# EAGLE design Adafruit Voice Bonnet (EAGLE 9.6.2)

## Sheet 1 of 2: I2S Audio
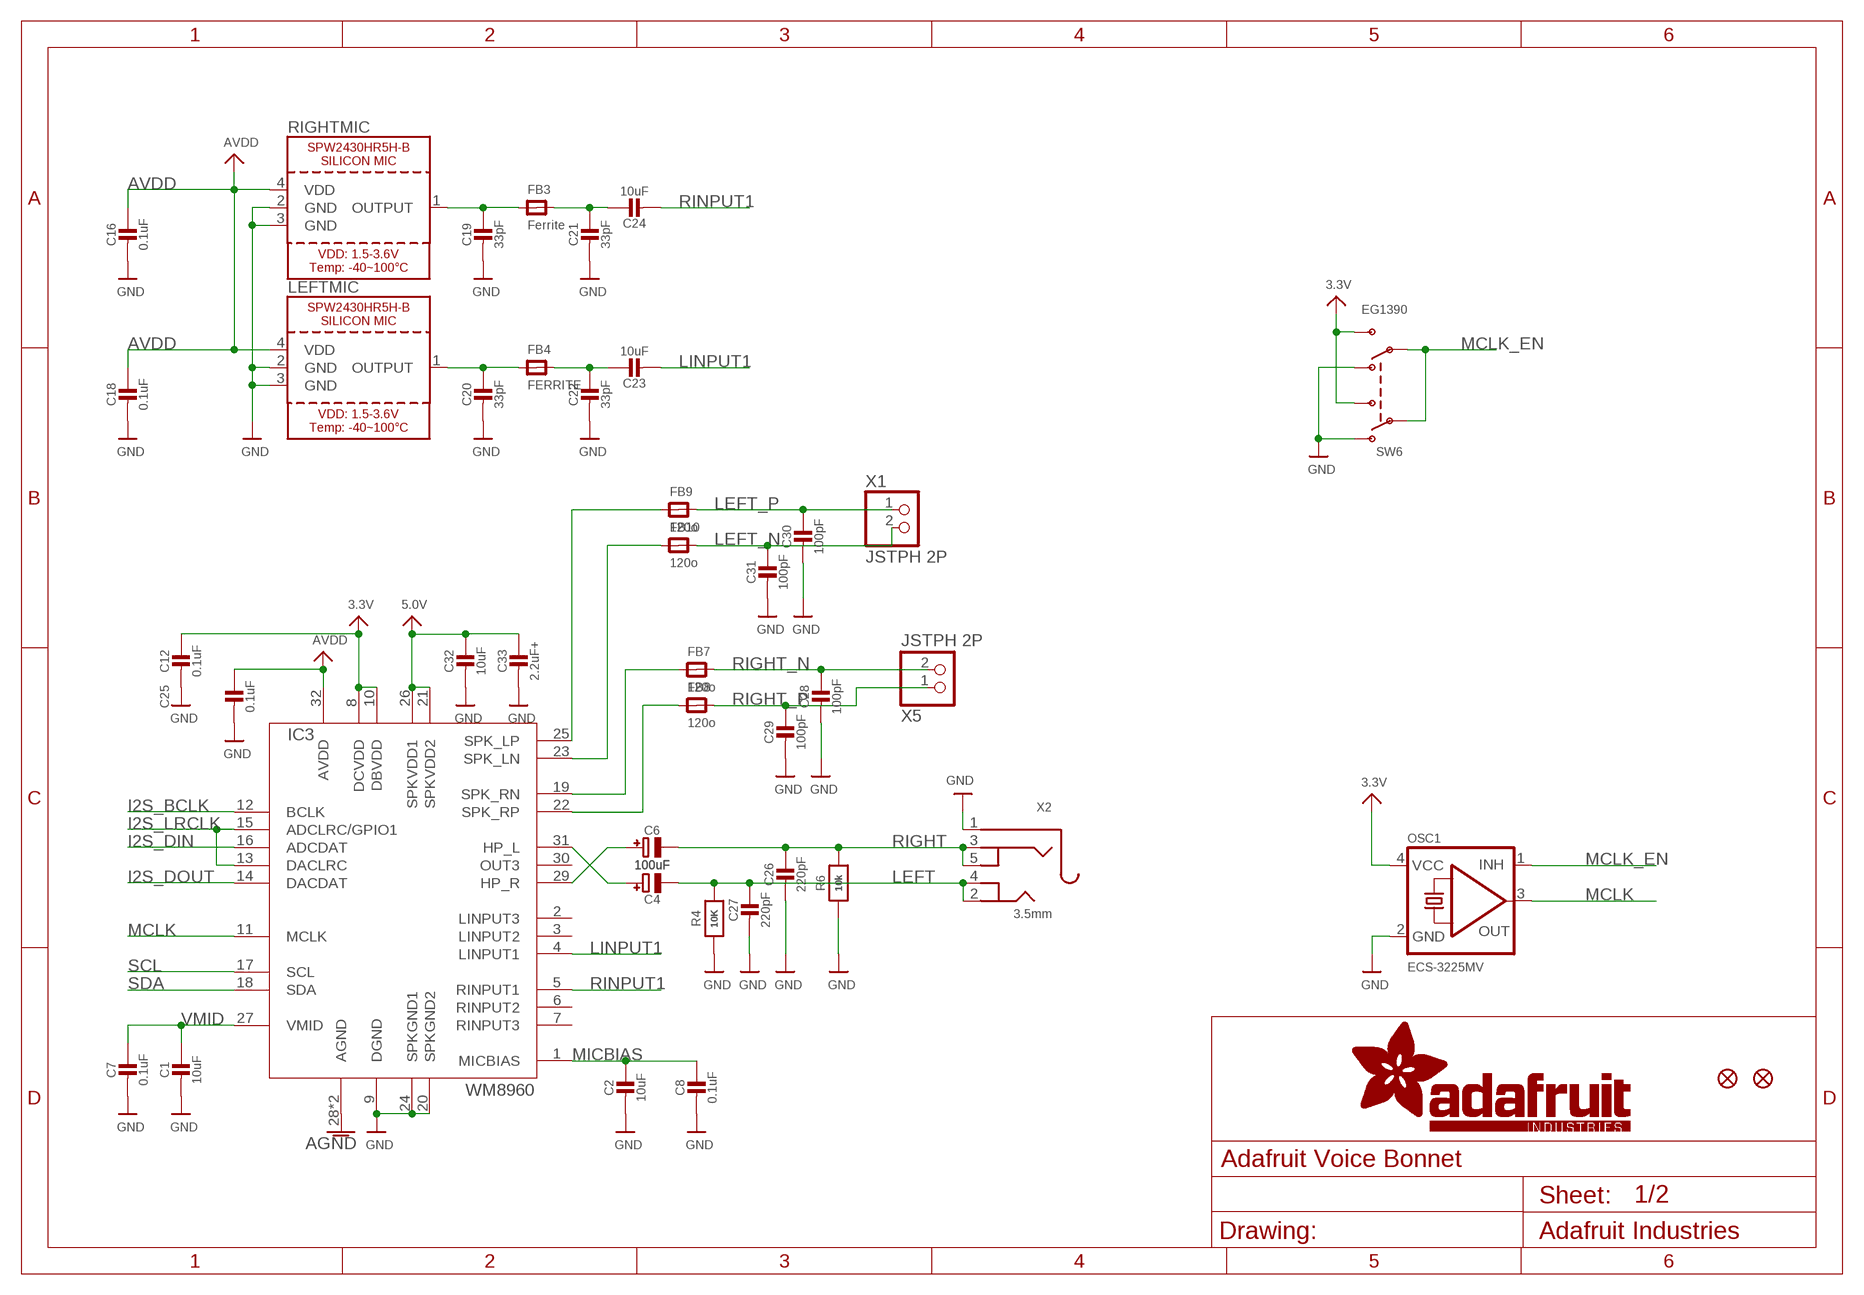
[diagram p0: schematic, sheet 1]

### Parts
C1  10uF  CAP_CERAMIC0805-NOOUTLINE  [0805-NO]
C2  10uF  CAP_CERAMIC0805-NOOUTLINE  [0805-NO]
C4  100uF  CAP_ELECTROLYTICPANASONIC_C  [PANASONIC_C]
C6  100uF  CAP_ELECTROLYTICPANASONIC_C  [PANASONIC_C]
C7  0.1uF  CAP_CERAMIC0603_NO  [0603-NO]
C8  0.1uF  CAP_CERAMIC0603_NO  [0603-NO]
C12  0.1uF  CAP_CERAMIC0603_NO  [0603-NO]
C16  0.1uF  CAP_CERAMIC0603_NO  [0603-NO]
C18  0.1uF  CAP_CERAMIC0603_NO  [0603-NO]
C19  33pF  CAP_CERAMIC0603_NO  [0603-NO]
C20  33pF  CAP_CERAMIC0603_NO  [0603-NO]
C21  33pF  CAP_CERAMIC0603_NO  [0603-NO]
C22  33pF  CAP_CERAMIC0603_NO  [0603-NO]
C23  10uF  CAP_CERAMIC0805-NOOUTLINE  [0805-NO]
C24  10uF  CAP_CERAMIC0805-NOOUTLINE  [0805-NO]
C25  0.1uF  CAP_CERAMIC0603_NO  [0603-NO]
C26  220pF  CAP_CERAMIC0603_NO  [0603-NO]
C27  220pF  CAP_CERAMIC0603_NO  [0603-NO]
C28  100pF  CAP_CERAMIC0603_NO  [0603-NO]
C29  100pF  CAP_CERAMIC0603_NO  [0603-NO]
C30  100pF  CAP_CERAMIC0603_NO  [0603-NO]
C31  100pF  CAP_CERAMIC0603_NO  [0603-NO]
C32  10uF  CAP_CERAMIC0805-NOOUTLINE  [0805-NO]
C33  2.2uF+  CAP_CERAMIC0805-NOOUTLINE  [0805-NO]
FB3  Ferrite  FERRITE-0805NO  [0805-NO]
FB4  FERRITE  FERRITE-0805NO  [0805-NO]
FB7  120o  FERRITE-0805NO  [0805-NO]
FB8  120o  FERRITE-0805NO  [0805-NO]
FB9  120o  FERRITE-0805NO  [0805-NO]
FB10  120o  FERRITE-0805NO  [0805-NO]
FID1  FIDUCIAL_1MM  [FIDUCIAL_1MM]
FID2  FIDUCIAL_1MM  [FIDUCIAL_1MM]
IC3  WM8960  [QFN32_5MM]
LEFTMIC  SPW2430HR5H-B  [SPW2430HR5H-B]
OSC1  ECS-3225MV  OSCILLATOR3.2X2.5  [OSC_3.2X2.5MM]
R4  10K  RESISTOR_0603_NOOUT  [0603-NO]
R6  10k  RESISTOR_0603_NOOUT  [0603-NO]
RIGHTMIC  SPW2430HR5H-B  [SPW2430HR5H-B]
SW6  EG1390  SWITCH_DPDTEG1390  [EG1390]
X1  JSTPH 2P  CON_JST_PH_2PIN  [JSTPH2]
X2  3.5mm  AUDIO_3.5MMJACK  [4UCONN_19269]
X5  JSTPH 2P  CON_JST_PH_2PIN  [JSTPH2]

### Nets
3.3V: C12.1 IC3.8(DCVDD) IC3.10(DBVDD) OSC1.4(VCC) SW6.S1 SW6.S2 ; also sheet 2
5.0V: C32.1 C33.1 IC3.21(SPKVDD2) IC3.26(SPKVDD1) ; also sheet 2
AGND: IC3.28(AGND) IC3.33(AGND) ; also sheet 2
AVDD: C16.1 C18.1 C25.1 IC3.32(AVDD) LEFTMIC.4(VDD) RIGHTMIC.4(VDD) ; also sheet 2
GND: C1.2 C2.2 C7.2 C8.2 C12.2 C16.2 C18.2 C19.2 C20.2 C21.2 C22.2 C25.2 C26.2 C27.2 C28.2 C29.2 C30.2 C31.2 C32.2 C33.2 IC3.9(DGND) IC3.20(SPKGND2) IC3.24(SPKGND1) LEFTMIC.2(GND) LEFTMIC.3(GND) OSC1.2(GND) R4.1 R6.1 RIGHTMIC.2(GND) RIGHTMIC.3(GND) SW6.O1 SW6.O2 X2.1 ; also sheet 2
I2S_BCLK: IC3.12(BCLK) ; also sheet 2
I2S_DIN: IC3.16(ADCDAT) ; also sheet 2
I2S_DOUT: IC3.14(DACDAT) ; also sheet 2
I2S_LRCLK: IC3.13(DACLRC) IC3.15(ADCLRC/GPIO1) ; also sheet 2
LEFT: C4.- C27.1 R4.2 X2.2 X2.4
LEFT_N: C31.1 FB10.2 X1.2
LEFT_P: C30.1 FB9.2 X1.1
LINPUT1: C23.2 IC3.4(LINPUT1)
MCLK: IC3.11(MCLK) OSC1.3(OUT)
MCLK_EN: OSC1.1(INH) SW6.P1 SW6.P2
MICBIAS: C2.1 C8.1 IC3.1(MICBIAS)
N$1: FB7.1 IC3.19(SPK_RN)
N$2: FB8.1 IC3.22(SPK_RP)
N$3: C6.+ IC3.29(HP_R)
N$5: C4.+ IC3.31(HP_L)
N$12: C19.1 FB3.1 RIGHTMIC.1(OUTPUT)
N$13: C20.1 FB4.1 LEFTMIC.1(OUTPUT)
N$16: C21.1 C24.1 FB3.2
N$17: C22.1 C23.1 FB4.2
N$21: FB9.1 IC3.25(SPK_LP)
N$22: FB10.1 IC3.23(SPK_LN)
RIGHT: C6.- C26.1 R6.2 X2.3 X2.5
RIGHT_N: C28.1 FB7.2 X5.2
RIGHT_P: C29.1 FB8.2 X5.1
RINPUT1: C24.2 IC3.5(RINPUT1)
SCL: IC3.17(SCL) ; also sheet 2
SDA: IC3.18(SDA) ; also sheet 2
VMID: C1.1 C7.1 IC3.27(VMID)
Unconnected: IC3.2(LINPUT3) IC3.3(LINPUT2) IC3.6(RINPUT2) IC3.7(RINPUT3) IC3.30(OUT3)

## Sheet 2 of 2: RasPi Hat & Power
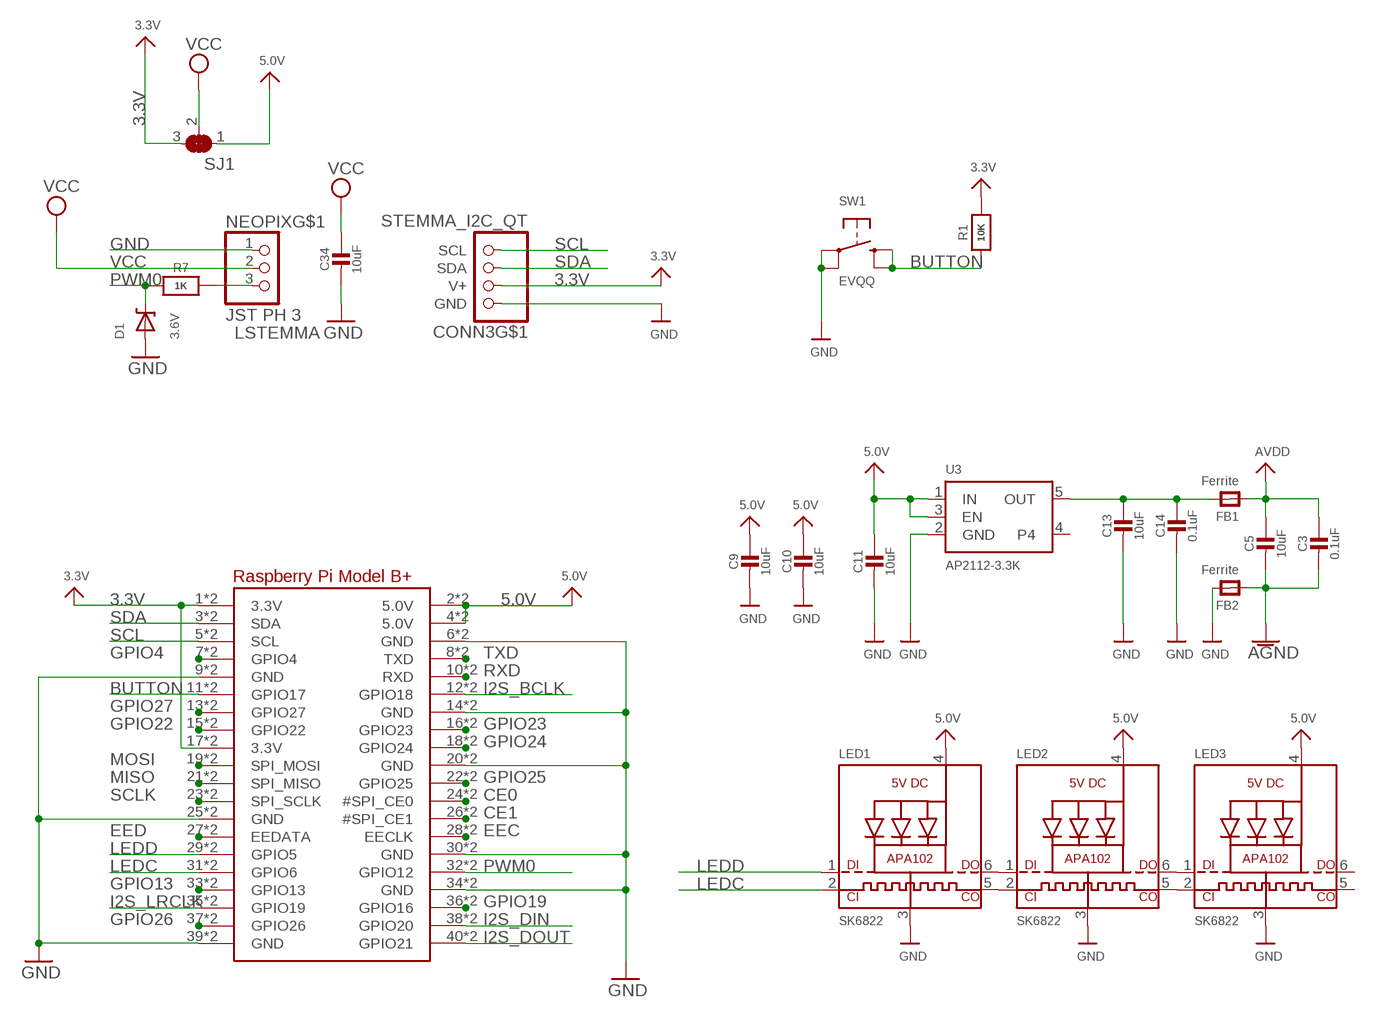
[diagram p1: schematic, sheet 2]

### Parts
C3  0.1uF  CAP_CERAMIC0603_NO  [0603-NO]
C5  10uF  CAP_CERAMIC0805-NOOUTLINE  [0805-NO]
C9  10uF  CAP_CERAMIC0805-NOOUTLINE  [0805-NO]
C10  10uF  CAP_CERAMIC0805-NOOUTLINE  [0805-NO]
C11  10uF  CAP_CERAMIC0805-NOOUTLINE  [0805-NO]
C13  10uF  CAP_CERAMIC0805-NOOUTLINE  [0805-NO]
C14  0.1uF  CAP_CERAMIC0603_NO  [0603-NO]
C34  10uF  CAP_CERAMIC0805-NOOUTLINE  [0805-NO]
CONN3  STEMMA_I2C_QT  [JST_SH4]
D1  3.6V  DIODE-ZENERSOD323  [SOD-323]
FB1  Ferrite  FERRITE0805  [0805]
FB2  Ferrite  FERRITE0805  [0805]
LED1  SK6822  APA102  [APA102]
LED2  SK6822  APA102  [APA102]
LED3  SK6822  APA102  [APA102]
NEOPIX  JST PH 3  CON_JST_PH_3PIN  [JSTPH3]
R1  10K  RESISTOR_0603_NOOUT  [0603-NO]
R7  1K  RESISTOR_0603_NOOUT  [0603-NO]
RPI1  RASPBERRYPI_BPLUS_BONNET_THMSMT  [PI_BONNET_THMSMT]
SJ1  SOLDERJUMPER_2WAY  [SOLDERJUMPER_2WAY_OPEN_NOPASTE]
SW1  EVQQ  SWITCH_TACT_SMT_EVQQ2_SMALL  [EVQ-Q2_SMALLER]
U3  AP2112-3.3K  VREG_SOT23-5  [SOT23-5]

### Nets
3.3V: CONN3.2(V+) R1.2 RPI1.1(3.3V) RPI1.17(3.3V) RPI1.S1(3.3V) RPI1.S17(3.3V) SJ1.3 ; also sheet 1
5.0V: C9.1 C10.1 C11.1 LED1.4(VDD) LED2.4(VDD) LED3.4(VDD) RPI1.2(5.0V) RPI1.4(5.0V) RPI1.S2(5.0V) RPI1.S4(5.0V) SJ1.1 U3.1(IN) U3.3(EN) ; also sheet 1
AGND: C3.2 C5.2 FB2.1 ; also sheet 1
AVDD: C3.1 C5.1 FB1.1 ; also sheet 1
BUTTON: R1.1 RPI1.11(GPIO17) RPI1.S11(GPIO17) SW1.B'(S1) SW1.B(S)
CE0: RPI1.24(#SPI_CE0) RPI1.S24(#SPI_CE0)
CE1: RPI1.26(#SPI_CE1) RPI1.S26(#SPI_CE1)
EEC: RPI1.28(EECLK) RPI1.S28(EECLK)
EED: RPI1.27(EEDATA) RPI1.S27(EEDATA)
GND: C9.2 C10.2 C11.2 C13.2 C14.2 C34.2 CONN3.1(GND) D1.A FB2.2 LED1.3(GND) LED2.3(GND) LED3.3(GND) NEOPIX.1 RPI1.6(GND) RPI1.9(GND) RPI1.14(GND) RPI1.20(GND) RPI1.25(GND) RPI1.30(GND) RPI1.34(GND) RPI1.39(GND) RPI1.S6(GND) RPI1.S9(GND) RPI1.S14(GND) RPI1.S20(GND) RPI1.S25(GND) RPI1.S30(GND) RPI1.S34(GND) RPI1.S39(GND) SW1.A'(P1) SW1.A(P) U3.2(GND) ; also sheet 1
GPIO4: RPI1.7(GPIO4) RPI1.S7(GPIO4)
GPIO13: RPI1.33(GPIO13) RPI1.S33(GPIO13)
GPIO19: RPI1.36(GPIO16) RPI1.S36(GPIO16)
GPIO22: RPI1.15(GPIO22) RPI1.S15(GPIO22)
GPIO23: RPI1.16(GPIO23) RPI1.S16(GPIO23)
GPIO24: RPI1.18(GPIO24) RPI1.S18(GPIO24)
GPIO25: RPI1.22(GPIO25) RPI1.S22(GPIO25)
GPIO26: RPI1.37(GPIO26) RPI1.S37(GPIO26)
GPIO27: RPI1.13(GPIO27) RPI1.S13(GPIO27)
I2S_BCLK: RPI1.12(GPIO18) RPI1.S12(GPIO18) ; also sheet 1
I2S_DIN: RPI1.38(GPIO20) RPI1.S38(GPIO20) ; also sheet 1
I2S_DOUT: RPI1.40(GPIO21) RPI1.S40(GPIO21) ; also sheet 1
I2S_LRCLK: RPI1.35(GPIO19) RPI1.S35(GPIO19) ; also sheet 1
LEDC: LED1.2(CKI) RPI1.31(GPIO6) RPI1.S31(GPIO6)
LEDD: LED1.1(DI) RPI1.29(GPIO5) RPI1.S29(GPIO5)
LSTEMMA: NEOPIX.3 R7.1
MISO: RPI1.21(SPI_MISO) RPI1.S21(SPI_MISO)
MOSI: RPI1.19(SPI_MOSI) RPI1.S19(SPI_MOSI)
N$7: LED1.6(DO) LED2.1(DI)
N$11: LED1.5(CKO) LED2.2(CKI)
N$14: LED2.6(DO) LED3.1(DI)
N$15: LED2.5(CKO) LED3.2(CKI)
OUT: C13.1 C14.1 FB1.2 U3.5(OUT)
PWM0: D1.C R7.2 RPI1.32(GPIO12) RPI1.S32(GPIO12)
RXD: RPI1.10(RXD) RPI1.S10(RXD)
SCL: CONN3.4(SCL) RPI1.5(SCL) RPI1.S5(SCL) ; also sheet 1
SCLK: RPI1.23(SPI_SCLK) RPI1.S23(SPI_SCLK)
SDA: CONN3.3(SDA) RPI1.3(SDA) RPI1.S3(SDA) ; also sheet 1
TXD: RPI1.8(TXD) RPI1.S8(TXD)
VCC [power]: C34.1 NEOPIX.2 SJ1.2
Unconnected: CONN3.MT1(MT) CONN3.MT2(MT) LED3.5(CKO) LED3.6(DO) NEOPIX.NC1(MT) NEOPIX.NC2(MT) U3.4

## Library data of the parts
C1-C3 C5 C7-C14 C16 C18-C34 = microbuilder:CAP_CERAMIC: Ceramic Capacitors For new designs, use the packages preceded by an '_' character since they are more reliable: The following footprints should be used on most boards: _0402 - Standard footprint for regular board layouts _0603 - Standard footprint for regular board layouts _0805 - Standard footprint for regular board layouts _1206 - Standard footprint for regular board layouts For extremely tight-pitch boards where space is at a premium, the following 'micro-pitch' footprints can be used (smaller pads, no silkscreen outline, etc.): _0402MP - Micro-pitch footprint for very dense/compact boards _0603MP - Micro-pitch footprint for very dense/compact boards _0805MP - Micro-pitch footprint for very dense/compact boards _1206MP - Micro-pitch footprint for very dense/compact boards
C4 C6 = microbuilder:CAP_ELECTROLYTIC: Electrolytic Capacitors SMT PANASONIC_C - Size C Panasonic Electrolytic Aluminum Capacitor 47µF 16V 20% Electrolytic Capacitor [Digikey: PCE3890TR-ND] PANASONIC_D - Size D Panasonic Electrolytic Aluminum Capacitor 100µF 25V 20% Electrolytic Capacitor [Digikey: PCE3898TR-ND] PTH 3.5 mm grid, 8 mm diameter ... 3.5 mm grid, 10 mm diameter ...
CONN3 = microbuilder:STEMMA_I2C
D1 = microbuilder:DIODE-ZENER: Zener Diode SMA: 30V 1W Zener Diode, 1.2Vf - Digikey: SMAZ30-FDICT-ND
FB1-FB4 FB7-FB10 = microbuilder:FERRITE: Ferrite Bead 0603 MMZ1608B121C - 120 Ohm @ 100MHz, 600mA, 0.15 Ohm DC Resistance - Digikey: 445-2164-1-ND BK1608HW121-T - 120 Ohm, 600mA Ferrite Chip - Digikey: 587-1876-2-ND 0805 HZ0805B272R-10 - 2.7K Ohm @ 100MHz, 200mA, 0.8 Ohm DC Resistance - Digikey: 240-2504-1-ND (see also Murata BLM21BD272SN1L) MMZ2012Y152B - 1.5K Ohm @ 100MHz, 500mA, 0.4 Ohm DC Resistance - Digikey: 445-1560-1-ND - Mainly for high frequency (80-400MHz) MMZ2012R102A - 1K Ohm @ 100MHz, 500mA, 0.3 Ohm DC Resistance - Digikey: 445-1555-2-ND - More general purpose (10-200MHz)
FID1 FID2 = microbuilder:FIDUCIAL: Fiducial Alignment Points Various fiducial points for machine vision alignment.; BOM: EXCLUDE
IC3 = microbuilder:WM8960
LED1-LED3 = microbuilder:APA102: APA102/DotStar Pixels VCC: 5V DC Refresh Rate: 400Hz
LEFTMIC RIGHTMIC = microbuilder:SPW2430HR5H-B: SPW2430HR5H-B - Silicon Microphone
NEOPIX = microbuilder:CON_JST_PH_3PIN
OSC1 = microbuilder:OSCILLATOR: Oscillators 3.2x2.5mm SMT 4.0MHz +/- 50ppm, 3.3V, 9mA, -40/+85°C - Digikey: 535-9752-1-ND 50MHz +/- 50ppm, 3.3V, 8mA, -10/+70°C - Digikey: 478-4792-1-ND 5x7mm SMT 4.0MHz +/-20ppm 3.3V, 20mA, -20/+70°C - Digikey: 535-9329-2-ND 50MHz +/- 25ppm 3.3V, 35mA, -40/+85°C - Digikey: 631-1197-1-ND
R1 R4 R6 R7 = microbuilder:RESISTOR: Resistors For new designs, use the packages preceded by an '_' character since they are more reliable: The following footprints should be used on most boards: _0402 - Standard footprint for regular board layouts _0603 - Standard footprint for regular board layouts _0805 - Standard footprint for regular board layouts _1206 - Standard footprint for regular board layouts For extremely tight-pitch boards where space is at a premium, the following 'micro-pitch' footprints can be used (smaller pads, no silkscreen outline, etc.): _0402MP - Micro-pitch footprint for very dense/compact boards _0603MP - Micro-pitch footprint for very dense/compact boards _0805MP - Micro-pitch footprint for very dense/compact boards _1206MP - Micro-pitch footprint for very dense/compact boards
RPI1 = adafruit_sbc:RASPBERRYPI_BPLUS
SJ1 = microbuilder:SOLDERJUMPER_2WAY: 2-Way Solder Jumper
SW1 = microbuilder:SWITCH_TACT_SMT: SMT Tact Switches 6x6mm - Digikey: P12940SCT-ND KMR2 (4.6x2.8mm) - Digikey: 401-1426-1-ND EVQ-PQHB55 - Light Touch, 160GF (4.5x4.5mm) - Digikey: P8090SCT-ND KMT0 - KMT021 NGJ LHS (etc.) IP68/Waterproof - Digikey: CKN10289CT-ND
SW6 = microbuilder:SWITCH_DPDT: Switch - DPDT A DPDT Switch acts like an SPDT switch, but has a pair of switches instead of just one. Vertical - 0.3A @ 6V SMT - Digikey: JS202011SCQN
U3 = microbuilder:VREG_SOT23-5: SOT23-5 Fixed Voltage Regulators Part Current Out V Out V In V Dropout θJA (°C/W) TJ (°C) Digikey Part No. ADP121 150mA 3.3V 3.4-5.5V 0.09V @ 150mA -- -- ADP121-AUJZ33R7CT-ND ADP121 150mA 3.0V 3.1-5.5V 0.09V @ 150mA -- -- ADP121-AUJZ30R7CT-ND ADP122 300mA 3.3V 3.4-5.5V 0.085V @ 300mA -- -- ADP122AUJZ-3.3-R7CT-ND ADP1712 300mA 3.3V 3.5-5.5V 0.17V @ 300mA -- -- ADP1712AUJZ-3.3-R7TR-ND AP7311 (Low Cost) 150mA 3.3V 3.5-6V 0.15V @ 150mA -- -- AP7311-33WG-7DICT-ND LD39015M18R 150mA 1.8V 1.9V-5.5V 0.08V @ 100mA -- -- 497-6977-1-ND LP2985A-33DBVR 150mA 3.3V 3.3-16V 0.28V @ 150mA 206 150 296-18479-1-ND MCP1824T-3302E/OT 300mA 3.3V 3.5V-6V 0.2V @ 300mA -- -- MCP1824T-3302E/OTCT-ND MIC5205-2.5YM5 TR 150mA 2.5V 2.7-16V 0.165V @ 150mA -- -- 576-1257-2-ND MIC5205-3.0YM5 TR 150mA 3.0V 3.2V-16V 0.165V @ 150mA -- -- 576-1258-2-ND MIC5205-3.3YM5 TR 150mA 3.3V 3.5V-16V 0.165V @ 150mA -- -- 576-1259-2-ND TPS780330220 150mA 3.3V+2.2V 3.6-5.5V 250mV Max -- -- 296-23332-1-ND TDA3663/N1,135 100mA 3.3V 3.5-45V 0.18V @ 50mA -- -- 568-5343-1-ND Max operating temp can be calculated using θJA, TJ (max junction temperature), and power in watts. Set the "Maximum Ambient Temperature" until it reaches TJ ("Max Junction Temperature"), which is the absolute limit for safe use of the regulator: Heat Sink Temperature Calculator <http://www.daycounter.com/Calculators/Heat-Sink-Temperature-Calculator.phtml> For example, With 12V source into a 3.3V LP2985 and a 30mA load, we are dissipating (12V-3.3V) * 0.03A = 0.261W. With a θJA of 206 °C/W, a TJ of 150°C, and 261mW we can safely use the chip without a heat sink up to 75°C (=147.1°C Junction Temperature).
X1 X5 = microbuilder:CON_JST_PH_2PIN: JST 2-Pin Right-Angle Connector PH-Series - 4UConnector: 17311 SH-Series - 4UConnector: 07278
X2 = microbuilder:AUDIO_3.5MMJACK: 3.5MM Audio Jack These are normally connected as follows, from left-to right on the schematic symbol above: Tip: Left Audio Inner Ring: Right Audio Shell: Common/GND

## Net classes
1 power: width 0.305 mm

## Board
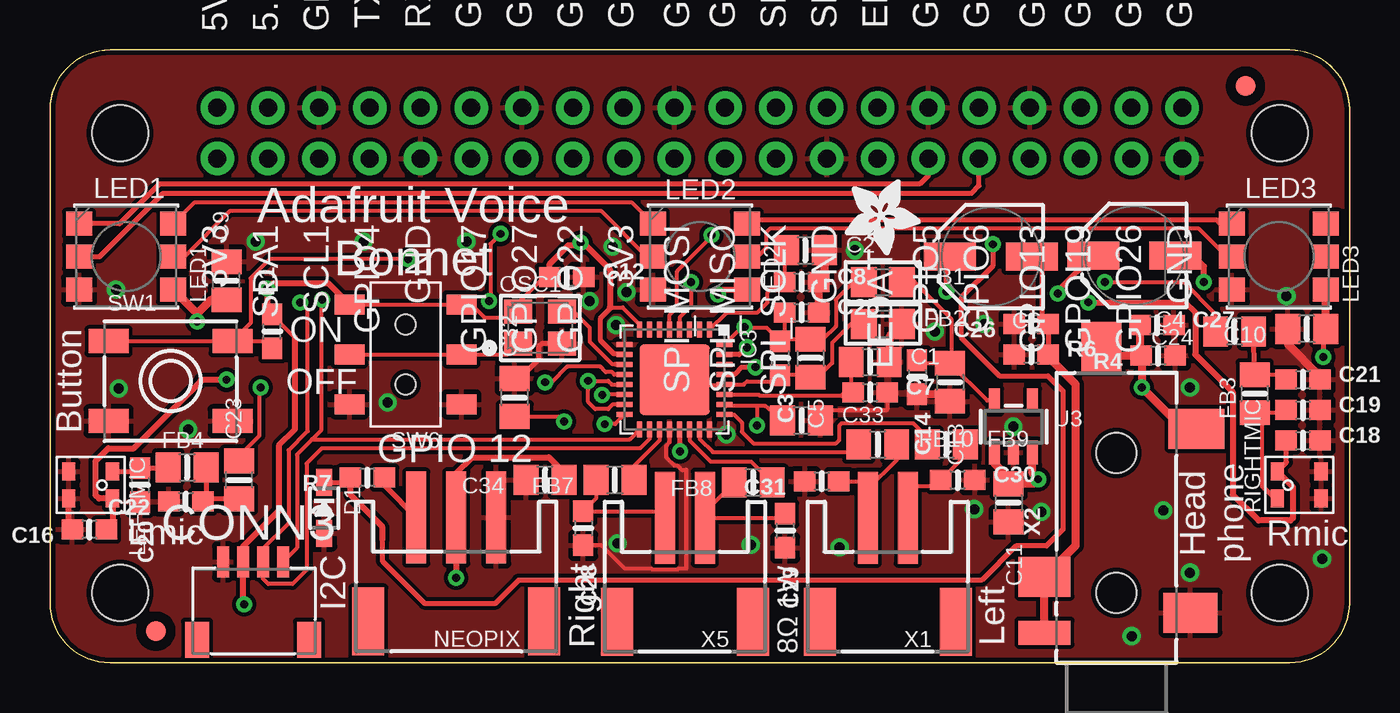
[diagram p2: board, top side]
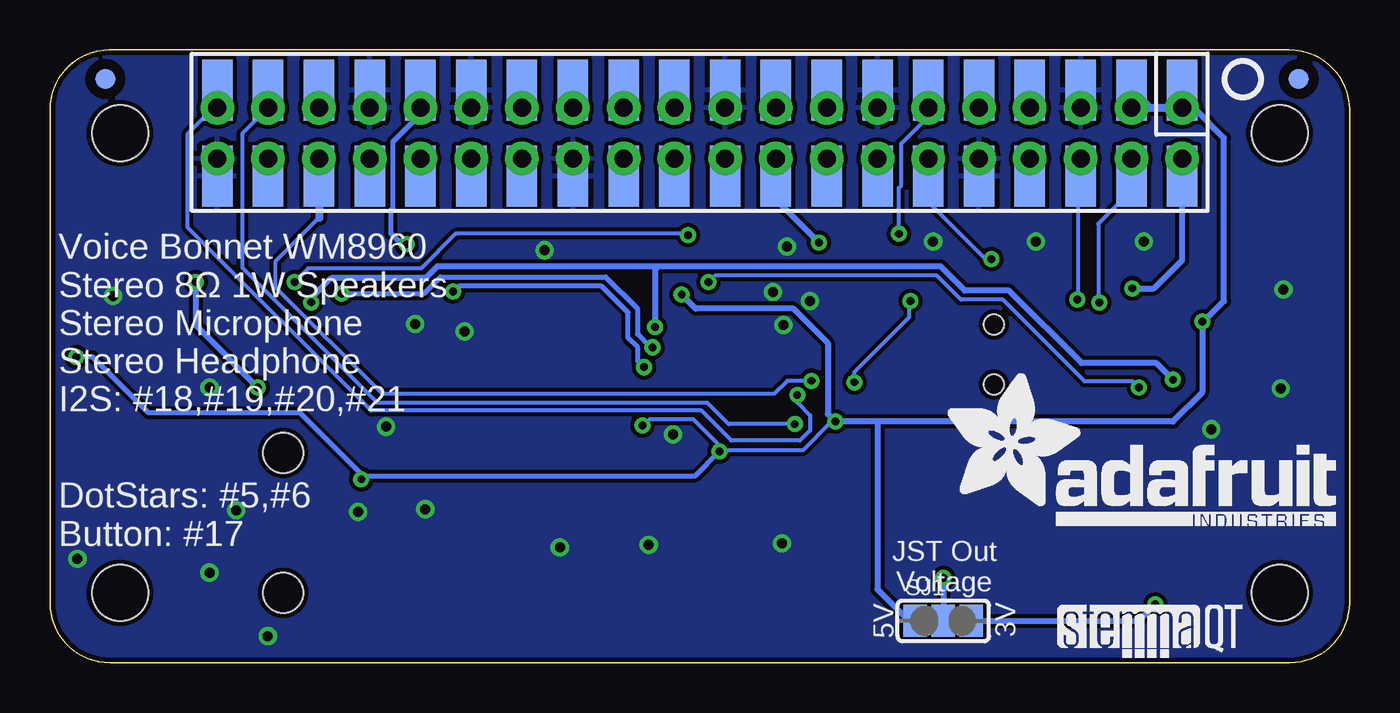
[diagram p3: board, bottom side, seen from below]

Size 65 x 30.66 mm. Coordinates in mm from the lower left corner, seen from the top.
Outline: 62,0 3,0 arc-90 0,3 0,27.7 arc-90 3.02,30.66 62.02,30.66 arc-90 65,27.7 65,3 arc-90 62,0
Copper layers (1*16): Top 0.035mm / dielectric 1.5mm / Bottom 0.035mm
Design rules "adafruit": minimum track width 8mil, minimum drill 15.5mil, track to track 8mil, track to pad 8mil, pad to pad 8mil, via to via 8mil, smd to smd 8mil, copper to edge 10mil, drill to drill 8mil, minimum pad ring 10mil, minimum via ring 8mil, stop-mask expansion 2mil, vias tented up to drill 20mil, thermal gap 10mil

### Footprints (pad centres in the part's own frame; a part is rotated, then mirrored left to right if it is on the bottom)
0805-NO = smd 1.24 x 1.5: 1 -0.95,0; 2 0.95,0
0603-NO = smd 1.075 x 1: 1 -0.85,0; 2 0.85,0
PANASONIC_C = smd 2.6 x 1.4: + 2.05,0; - -2.05,0
JST_SH4 = smd 0.6 x 1.55: 1 -1.5,2.514; 2 -0.5,2.514; 3 0.5,2.514; 4 1.5,2.514 | smd 1.2 x 1.8: MT1 -2.8,-1.386; MT2 2.8,-1.386
SOD-323 = smd 1.35 x 0.8: A 1.27,0; C -1.27,0
0805 = smd 1.3 x 1.5: 1 -0.95,0; 2 0.95,0
FIDUCIAL_1MM = smd 1 x 1: 1 0,0
QFN32_5MM = smd 0.8 x 0.25: 1 -2.5,1.75; 2 -2.5,1.25; 3 -2.5,0.75; 4 -2.5,0.25; 5 -2.5,-0.25; 6 -2.5,-0.75; 7 -2.5,-1.25; 8 -2.5,-1.75; 17 2.5,-1.75; 18 2.5,-1.25; 19 2.5,-0.75; 20 2.5,-0.25; 21 2.5,0.25; 22 2.5,0.75; 23 2.5,1.25; 24 2.5,1.75 | smd 0.25 x 0.8: 9 -1.75,-2.5; 10 -1.25,-2.5; 11 -0.75,-2.5; 12 -0.25,-2.5; 13 0.25,-2.5; 14 0.75,-2.5; 15 1.25,-2.5; 16 1.75,-2.5; 25 1.75,2.5; 26 1.25,2.5; 27 0.75,2.5; 28 0.25,2.5; 29 -0.25,2.5; 30 -0.75,2.5; 31 -1.25,2.5; 32 -1.75,2.5 | smd 3.5 x 3.5: 33 0,0
APA102 = smd 1.3 x 1.2: 1 -2.35,1.65; 2 -2.35,0; 3 -2.35,-1.65; 4 2.35,-1.65; 5 2.35,0; 6 2.35,1.65
SPW2430HR5H-B = smd 0.9 x 0.66: 1 -0.675,1.095; 2 -0.675,-1.095; 3 0.675,-1.095; 4 0.675,1.095
JSTPH3 = smd 1 x 4.6: 1 -2,-2.7; 2 0,-2.7; 3 2,-2.7 | smd 1.6 x 3.4: NC1 -4.4,2.5; NC2 4.4,2.5
OSC_3.2X2.5MM = smd 1.4 x 1.2: 1 -1.1,-0.8; 2 1.1,-0.8; 3 1.1,0.8; 4 -1.1,0.8
PI_BONNET_THMSMT = drill 0.9 pad 1.676: 1 8.37,25.23; 2 8.37,27.77; 3 10.91,25.23; 4 10.91,27.77; 5 13.45,25.23; 6 13.45,27.77; 7 15.99,25.23; 8 15.99,27.77; 9 18.53,25.23; 10 18.53,27.77; 11 21.07,25.23; 12 21.07,27.77; 13 23.61,25.23; 14 23.61,27.77; 15 26.15,25.23; 16 26.15,27.77; 17 28.69,25.23; 18 28.69,27.77; 19 31.23,25.23; 20 31.23,27.77; 21 33.77,25.23; 22 33.77,27.77; 23 36.31,25.23; 24 36.31,27.77; 25 38.85,25.23; 26 38.85,27.77; 27 41.39,25.23; 28 41.39,27.77; 29 43.93,25.23; 30 43.93,27.77; 31 46.47,25.23; 32 46.47,27.77; 33 49.01,25.23; 34 49.01,27.77; 35 51.55,25.23; 36 51.55,27.77; 37 54.09,25.23; 38 54.09,27.77; 39 56.63,25.23; 40 56.63,27.77 | smd 1 x 1 bottom: 41 2.54,29.21; 42 62.23,29.21 | smd 1.524 x 3.048 bottom: S1 8.37,24.339; S2 8.37,28.657; S3 10.91,24.339; S4 10.91,28.657; S5 13.45,24.339; S6 13.45,28.657; S7 15.99,24.339; S8 15.99,28.657; S9 18.53,24.339; S10 18.53,28.657; S11 21.07,24.339; S12 21.07,28.657; S13 23.61,24.339; S14 23.61,28.657; S15 26.15,24.339; S16 26.15,28.657; S17 28.69,24.339; S18 28.69,28.657; S19 31.23,24.339; S20 31.23,28.657; S21 33.77,24.339; S22 33.77,28.657; S23 36.31,24.339; S24 36.31,28.657; S25 38.85,24.339; S26 38.85,28.657; S27 41.39,24.339; S28 41.39,28.657; S29 43.93,24.339; S30 43.93,28.657; S31 46.47,24.339; S32 46.47,28.657; S33 49.01,24.339; S34 49.01,28.657; S35 51.55,24.339; S36 51.55,28.657; S37 54.09,24.339; S38 54.09,28.657; S39 56.63,24.339; S40 56.63,28.657 | hole 2.8: 3.5,26.5; 61.5,26.5; 61.5,3.5; 3.5,3.5
SOLDERJUMPER_2WAY_OPEN_NOPASTE = smd 1.168 x 1.6: 1 -1.397,0; 2 0,0; 3 1.397,0
EVQ-Q2_SMALLER = smd 2 x 1.2: A -3.1,-2; A' 3.1,-2; B -3.1,2; B' 3.1,2
EG1390 = smd 1 x 1.5: O1 -2.5,2.8; O2 -2.5,-2.8; P1 0,2.8; P2 0,-2.8; S1 2.5,2.8; S2 2.5,-2.8 | hole 1: 1.5,0; -1.5,0
SOT23-5 = smd 0.55 x 1.2: 1 -0.95,-1.3; 2 0,-1.3; 3 0.95,-1.3; 4 0.95,1.3; 5 -0.95,1.3
JSTPH2 = smd 1 x 4.6: 1 -1,-3.7; 2 1,-3.7 | smd 1.6 x 3.4: NC1 -3.4,1.5; NC2 3.4,1.5
4UCONN_19269 = smd 2 x 2.7: 1 2.5,-3.7 | smd 2 x 2.8: 2 11.7,-4 | smd 2 x 2.6: 3 4.3,3.6 | smd 2.5 x 2: 4 15.8,0.75 | smd 1.2 x 2.6: 5 1.5,3.6 | hole 2: 3.5,0; 10.5,0

### Placement (x,y rotation side)
C1  41.02,15.05 0 top
C2  37.78,20.64 0 top
C3  36.51,15.24 270 top
C4  54.23,20.38 180 top
C5  38.04,15.24 270 top
C6  47.05,20.32 180 top
C7  41.02,13.53 0 top
C8  37.59,19.05 0 top
C9  8.83,19.11 90 top
C10  62.87,16.7 180 top
C11  47.94,8 270 top
C12  25.84,19.3 0 top
C13  45.02,14.03 270 top
C14  43.37,14.29 270 top
C16  1.97,6.67 180 top
C18  62.67,11.11 0 top
C19  62.67,12.64 0 top
C20  4.51,8.89 270 top
C21  62.67,14.16 0 top
C22  6.79,8.06 180 top
C23  9.46,9.14 90 top
C24  59.25,16.57 180 top
C25  37.59,17.53 0 top
C26  49.09,16.95 180 top
C27  55.37,16.89 0 top
C28  26.67,6.73 270 top
C29  36.77,6.6 270 top
C30  45.4,9.14 0 top
C31  38.61,9.08 180 top
C32  23.24,13.27 90 top
C33  37.59,12.13 0 top
C34  24.77,9.14 180 top
CONN3  10.16,2.54 0 top
D1  13.72,7.75 270 top
FB1  41.66,19.05 0 top
FB2  41.66,16.95 0 top
FB3  60.26,13.46 90 top
FB4  6.86,9.78 0 top
FB7  28.26,9.14 180 top
FB8  35.18,9.02 180 top
FB9  44.83,10.92 0 top
FB10  41.4,10.92 0 top
FID1  5.3,1.58 0 top
FID2  59.8,28.85 0 top
IC3  31.24,14.16 270 top
LED1  3.81,20.32 0 top
LED2  32.51,20.32 0 top
LED3  61.47,20.32 0 top
LEFTMIC  2.03,8.89 270 top
NEOPIX  20.32,4.57 180 top
OSC1  24.51,16.76 0 top
R1  11.11,16.57 90 top
R4  55.44,15.37 180 top
R6  49.09,15.43 0 top
R7  15.88,9.27 180 top
RIGHTMIC  62.48,8.89 90 top
RPI1  0,0 0 top
SJ1  20.32,2.1 0 bottom
SW1  6.03,14.1 0 top
SW6  17.78,15.43 90 top
U3  48.2,11.81 0 top
U$11  [PCBFEAT-REV-040]  5.33,29.2 0 bottom
U$12  [STEMMAQT]  14.61,0.25 0 bottom
U$15  [ADAFRUIT_3.5MM]  39.75,24.19 270 top
U$16  [ADAFRUIT_TEXT_20MM]  20.26,6.86 0 bottom
U$79  [BRAINPAD_1IN]  43.81,0.25 0 bottom
X1  41.91,3.56 180 top
X2  53.34,0 90 top
X5  31.75,3.56 180 top

### Tracks (layer width: path | path; a pad name or v marks a point on that pad's centre or on a via)
3.3V  (via drill 0.39)
  Top 0.203: 28,17.78 28.07,17.78 28.64,17.78 29.49,16.93 IC3.8 | C12.1 24.71,19.3 23.41,18.01 OSC1.4 23.09,17.25 21.76,17.25 21.08,17.93 SW6.S2 SW6.S1 | 12.26,16.26 11.11,17.4 R1.2
  Top 0.254: IC3.10 28.7,15.46 28.2,15.46 27.54,16.12 27.54,17.25 28.07,17.78
  Top 0.305: v9.72,2.92 9.66,2.98 CONN3.2 9.66,5.82 11.44,7.59 11.44,10.87 12.26,11.68 12.26,16.26 | C12.1 24.99,19.95 25.93,20.89 26.61,20.89 | 26.61,20.89 26.8,20.89 28,19.68 28,17.78 | R1.2 10.86,17.68 v10.86,18.73 11.11,18.99 13.92,18.99 SW6.S1 | 26.61,20.89 26.61,20.95 v26.54,21.02
  Bottom 0.305: SJ1.3 10.54,2.1 v9.72,2.92 | v10.86,18.73 9.78,18.73 8.37,20.14 RPI1.S1 | v26.54,21.02 28.69,23.16 28.69,24.89
  Bottom 0.406: RPI1.S17 28.69,24.89 RPI1.17 | RPI1.17 | RPI1.S1 RPI1.1 | RPI1.1
5.0V  (via drill 0.39)
  Top 0.203: C32.1 25.45,12.32 v25.71,12.06 | C33.1 35.78,12.85 35.37,12.85 | 35.37,12.85 33.81,12.85 IC3.26 | 35.37,12.85 v35.37,11.87
  Top 0.254: IC3.21 31.49,10.59 v31.52,10.57 | v63.69,15.3 63.69,16.96 63.81,17.08
  Top 0.305: v33.4,18.41 33.66,18.67 LED2.4
  Top 0.406: LED3.4 63.82,17.34 63.81,17.33 63.81,17.08 C10.1 | U3.1 47.25,9.96 47.94,9.27 C11.1 49.19,8.95 v49.42,9.19 49.15,9.46 U3.3 | LED1.4 7.37,17.46 | 7.37,17.46 v7.37,17.08 | C9.1 8.07,18.16 7.37,17.46
  Bottom 0.203: v25.71,12.06 25.91,12.06 27.34,10.63 31.45,10.63 | v31.52,10.57 31.52,10.88 32.83,12.19 34.99,12.19 35.31,11.87 v35.37,11.87
  Bottom 0.254: 31.45,10.63 v31.52,10.57 32.72,9.36 49.25,9.36 | v49.42,9.19 49.25,9.36 | 49.25,9.36 49.33,9.36 52.48,12.51 60.07,12.51 62.87,15.3 v63.69,15.3
  Bottom 0.305: v7.37,17.08 7.37,17.02 | 7.37,17.02 7.37,13.53 8.83,12.06 23.62,12.06 | 23.62,12.06 v25.71,12.06 26.09,12.45 26.09,16 27.81,17.72 32.7,17.72 v33.4,18.41 | 23.62,12.06 23.62,3.68 22.04,2.1 SJ1.1 | 7.37,17.02 6.29,18.1 6.29,26.26 7.8,27.77 RPI1.2
  Bottom 0.406: RPI1.S4 | RPI1.S4 RPI1.4 | RPI1.S4 10.02,27.77 RPI1.2 RPI1.S2 | RPI1.S2
AGND
  Top 0.203: IC3.33 31.94,14.16 32.19,13.91 IC3.28 34.69,13.91 34.86,14.08 36.2,14.08 C3.2 37.94,14.39 C5.2 38.42,14.29 39.12,14.99 39.12,16 40.07,16.95 FB2.1
AVDD  (via drill 0.39)
  Top 0.203: FB1.1 40.2,19.05 39.31,18.16 39.31,16.83 38.67,16.19 C5.1 36.61,16.19 C3.1 | IC3.32 34.6,16.76 34.71,16.76 | C3.1 35.84,16.76 34.8,16.76 34.77,16.79 v34.73,16.79 | C25.1 36.74,16.32 C3.1
  Top 0.254: RIGHTMIC.4 61.85,10.03 61.85,11.09 C18.1
  Top 0.305: C16.1 3.13,6.98 LEFTMIC.4 2.45,8.21 2.29,8.38 2.29,10.1 2.92,10.73 4.19,10.73 7.56,14.1 7.56,14.16 v8.83,14.16 | v34.73,16.79 34.71,16.76 | RIGHTMIC.4 62.17,8.79 62.17,7.24 62.04,7.11 60.45,7.11 59.16,8.41 59.16,13.55 57.28,15.43 57.28,17.53 56.77,18.03 v51.94,18.03
  Bottom 0.305: v8.83,14.16 9.65,14.99 13.4,14.99 17.03,18.62 19.24,18.62 20.45,19.82 34.58,19.82 | v34.73,16.79 v34.73,16.8 34.73,19.68 34.58,19.82 | 34.58,19.82 45.63,19.82 46.22,19.24 50.93,19.24 52.04,18.13 v51.94,18.03
BUTTON  (via drill 0.39)
  Top 0.203: SW1.B SW1.B' | SW1.B' 10.03,17 10.03,19.24 10.99,20.19 v17.91,20.19 | SW1.B' 10.74,16.1 R1.1
  Bottom 0.203: RPI1.S11 21.07,23.04 18.22,20.19 v17.91,20.19
  Bottom 0.406: RPI1.S11 RPI1.11 | RPI1.11
CE0
  Bottom 0.406: RPI1.S24 | RPI1.S24 RPI1.24
CE1
  Bottom 0.406: RPI1.S26 | RPI1.S26 RPI1.26
EEC
  Bottom 0.406: RPI1.S28 | RPI1.S28 RPI1.28
EED
  Bottom 0.406: RPI1.S27 RPI1.27 | RPI1.27
GND  (via drill 0.5)
  Top 0.203: IC3.20 30.99,11.04 30.81,10.86 30.81,10.27 31.23,9.86 31.38,9.86 31.59,9.65 31.81,9.65 31.81,4.7 31.42,4.7 31.38,4.65 30.12,4.65 30.08,4.7 28.77,4.7 27.58,5.88 C28.2 | C33.2 38.78,12.64 41.85,12.64 41.91,12.7 41.91,13.49 C7.2
  Top 0.254: C32.2 23.49,14.22 24.45,15.18 24.45,15.81 24.6,15.96 OSC1.2
  Top 0.305: C16.2 0.94,6.85 LEFTMIC.3
  Top 0.406: C1.2 41.97,15.48 42.02,15.53 42.02,16.36 FB2.2 | C25.2 C8.2 38.73,19.34 C2.2 | C10.2 61.91,15.94 63.52,14.33 C21.2 | C14.2 44.67,13.44 C13.2
  Bottom 0.406: RPI1.S20 | RPI1.S20 RPI1.20 | RPI1.S25 RPI1.25 | RPI1.25 | RPI1.S30 | RPI1.S30 RPI1.30 | RPI1.S34 | RPI1.S34 RPI1.34 | RPI1.S39 RPI1.39 | RPI1.39 | RPI1.S6 | RPI1.S6 RPI1.6
  other vias: 3.3,18.67 10.29,21.08 16.89,13.02 6.92,11.68 3.43,13.72 28.83,18.54 26.99,18.1 20.83,21.08 15.68,21.08 28.13,20.83 35.05,5.91 28.38,5.97 39.5,5.78 46.23,7.68 49.59,7.56 46.74,16.95 44.26,16.57 40.26,20.64 57.02,13.78 61.85,18.35 55.69,7.62 63.63,5.21 57.02,4.51 54.1,1.33 28.32,16.89 48.2,11.81 33.85,11.43
  pour Bottom: 0,30.54 65.02,30.54 65.02,-0.06 0,-0.06
  pour Top: 0,30.61 65.02,30.61 65.02,0 0,0
GPIO4
  Bottom 0.406: RPI1.S7 RPI1.7 | RPI1.7
GPIO13
  Bottom 0.406: RPI1.S33 RPI1.33 | RPI1.33
GPIO19
  Bottom 0.406: RPI1.S36 | RPI1.S36 RPI1.36
GPIO22
  Bottom 0.406: RPI1.S15 RPI1.15 | RPI1.15
GPIO23
  Bottom 0.406: RPI1.S16 | RPI1.S16 RPI1.16
GPIO24
  Bottom 0.406: RPI1.S18 | RPI1.S18 RPI1.18
GPIO25
  Bottom 0.406: RPI1.S22 | RPI1.S22 RPI1.22
GPIO26
  Bottom 0.406: RPI1.S37 RPI1.37 | RPI1.37
GPIO27
  Bottom 0.406: RPI1.S13 RPI1.13 | RPI1.13
I2S_BCLK  (via drill 0.39)
  Top 0.203: IC3.12 28.23,14.41 28.1,14.54 27.8,14.54 27.53,14.81 25.86,14.81 25.08,14.03 v24.77,14.03 | v21.97,18.09 22.04,18.16 22.04,20.95 v22.54,21.46
  Bottom 0.203: v21.97,18.09 22.04,18.03 22.04,17.27 24.77,14.54 v24.77,14.03 | v22.54,21.46 22.54,23.75 22.42,23.88 22.42,25.98 21.07,27.33 RPI1.12
  Bottom 0.406: RPI1.S12 | RPI1.S12 RPI1.12
I2S_DIN  (via drill 0.39)
  Top 0.203: IC3.16 28.27,11.94 v27.75,11.94
  Bottom 0.203: v27.75,11.94 31.05,11.94 32.13,13.02 48.64,13.02 55.37,19.75 55.37,26.49 RPI1.38
  Bottom 0.406: RPI1.S38 | RPI1.S38 RPI1.38
I2S_DOUT  (via drill 0.39)
  Top 0.203: IC3.14 27.63,13.41 v27.62,13.4
  Bottom 0.203: v27.62,13.4 27.62,13.02 26.99,12.38 26.99,11.62 27.5,11.11 30.92,11.11 32.42,12.61 48.93,12.61 58.1,21.78 58.1,26.48 56.81,27.77 56.71,27.77 RPI1.40
  Bottom 0.406: RPI1.S40 56.71,28.58 56.71,27.77
I2S_LRCLK  (via drill 0.39)
  Top 0.203: IC3.15 28.13,12.91 27.91,12.69 27.27,12.69 26.92,13.04 26.92,13.69 26.92,13.7 26.92,13.91 27.12,14.1 | IC3.13 28.11,13.91 27.91,14.1 27.12,14.1 | 27.12,14.1 27.12,14.11 v26.91,14.11
  Bottom 0.203: v26.91,14.11 28.12,14.11 28.75,13.47 48.4,13.47 53.71,18.78 53.71,20.1 51.53,22.27 | 51.55,25.15 RPI1.35
  Bottom 0.406: 51.55,25.15 RPI1.S35 51.53,24.32 51.53,22.27 | 51.55,25.15
LEDC
  Top 0.254: LED1.2 2.48,20.32 5.65,23.5 46.1,23.5 46.47,23.86 RPI1.31
  Bottom 0.406: RPI1.S31 RPI1.31 | RPI1.31
LEDD
  Top 0.254: RPI1.29 43.93,24.37 43.51,23.95 5.46,23.95 3.48,21.97 LED1.1
  Bottom 0.406: RPI1.S29 RPI1.29 | RPI1.29
LEFT  (via drill 0.39)
  Top 0.305: C4.- 57.17,20.38 57.72,19.83 v57.72,19.05
  Top 0.406: C27.1 54.52,15.43 R4.2 | R4.2 54.61,15.34 v54.61,13.78 56.69,11.7 X2.2 | X2.4 53.02,15.37 R4.2
  Bottom 0.305: v57.72,19.05 57.72,16.89 v54.61,13.78
LEFT_N
  Top 0.203: FB10.2 42.35,10.16 40.83,8.64 | 40.83,8.64 40.83,8.95 40.7,9.08 C31.1 | 40.83,8.64 40.83,8.07 40.96,7.94 40.96,7.81 40.89,7.75 40.89,7.27 X1.2
LEFT_P
  Top 0.203: X1.1 42.91,8.43 43.31,8.83 44.23,8.83 C30.1 45.78,10.37 FB9.2
LINPUT1  (via drill 0.39)
  Top 0.203: C23.2 9.46,10.35 10.48,11.36 10.48,13.72 v10.54,13.78 | v32.07,19.05 32.07,17.84 31.49,17.27 IC3.4
  Bottom 0.203: v10.54,13.78 10.86,14.1 13.27,14.1 17.34,18.16 19.43,18.16 20.64,19.37 31.75,19.37 v32.07,19.05
LSTEMMA
  Top 0.254: R7.1 16.73,8.87 NEOPIX.3
MCLK
  Top 0.203: OSC1.3 26.19,17.56 26.99,16.76 26.99,16.06 28.1,14.95 28.27,14.95 28.31,14.91 IC3.11
MCLK_EN
  Top 0.203: SW6.P1 SW6.P2 22.88,15.43 OSC1.1
MICBIAS
  Top 0.203: IC3.1 33.86,17.53 35.4,17.53 35.9,18.03 35.9,18.53 36.1,18.73 36.42,18.73 C8.1 36.74,20.55 C2.1
MISO
  Bottom 0.406: RPI1.S21 RPI1.21 | RPI1.21
MOSI
  Bottom 0.406: RPI1.S19 RPI1.19 | RPI1.19
N$1
  Top 0.203: IC3.19 30.49,11.12 29.21,9.84 FB7.1
N$2
  Top 0.203: IC3.22 31.99,11.12 33.05,10.07 35.08,10.07 FB8.1
N$3  (via drill 0.4)
  Top 0.254: IC3.29 33.79,14.46 34.28,14.46 34.61,14.79 v35.29,14.79 | v44.83,18.57 44.83,20.15 C6.+
  Bottom 0.254: v35.29,14.79 35.59,15.09 35.59,15.77 36.08,16.26 36.08,17.53 37.4,18.85 44.56,18.85 v44.83,18.57
N$4
  Bottom 0.203: 20.83,2.1 21.21,2.1
N$5  (via drill 0.4)
  Top 0.254: C4.+ 50.42,18.62 v50.42,18.48 | v34.86,15.79 34.49,15.41 IC3.31
  Bottom 0.254: v50.42,18.48 46.29,18.48 45.47,19.3 37.21,19.3 35.62,17.72 35.62,16.45 34.96,15.79 v34.86,15.79
N$7
  Top 0.203: LED1.6 7.21,23.02 29.11,23.02 LED2.1
N$11
  Top 0.203: LED1.5 6.73,20.32 9.02,22.61 27.55,22.61 29.84,20.32 LED2.2
N$12
  Top 0.203: FB3.1 60.77,12.51 | 60.77,12.51 61.7,12.51 C19.1 | 60.64,8.83 60.64,12.38 60.77,12.51
  Top 0.254: RIGHTMIC.1 61.25,8.21 60.64,8.83
N$13
  Top 0.254: LEFTMIC.1 4.33,9.56 C20.1 5.87,9.74 FB4.1
N$14
  Top 0.254: LED2.6 35.05,22.16 58.35,22.16 58.55,21.97 LED3.1
N$15
  Top 0.203: LED3.2 58.86,20.32 57.47,21.72 36.01,21.72 35.82,21.53 35.82,20.74 35.4,20.32 LED2.5
N$16
  Top 0.203: FB3.2 61.57,14.41 C21.1
  Top 0.254: FB3.2 60.26,14.46 C24.1
N$17
  Top 0.254: FB4.2 7.81,8.39 8,8.19 C23.1 7.77,8.19 C22.1
N$21
  Top 0.203: FB9.1 43.88,11.28 43.18,11.98 39.6,11.98 39.47,11.84 39.47,11.12 39.32,10.98 35.19,10.98 34.61,11.56 34.61,12.02 34.22,12.41 IC3.25
N$22
  Top 0.203: IC3.23 32.49,11.2 33.15,10.54 40.07,10.54 FB10.1
OUT
  Top 0.203: U3.5 46.89,13.12 C13.1 | C13.1 43.52,14.98 C14.1 | FB1.2 43.24,19.05 45.09,17.21 45.09,15.05 C13.1
PWM0  (via drill 0.39)
  Top 0.254: R7.2 15.03,9.02 D1.C | 16.64,6.16 16.64,5.08 18.73,2.98 22.29,2.98 23.43,4.13 46.61,4.13 48.32,5.84 49.85,5.84 50.67,6.67 50.67,13.61 49.92,14.36 47.49,14.36 45.57,16.28 45.57,18.27 47.16,19.86 v47.16,20.94
  Top 0.305: 16.64,6.16 16.64,6.79 15.03,8.41 15.03,9.02
  Bottom 0.254: v47.16,20.94 47.41,20.94 47.94,21.47 47.94,22.65 47.84,22.75 47.84,26.07 46.47,27.44 RPI1.32
  Bottom 0.406: RPI1.S32 | RPI1.S32 RPI1.32
RIGHT
  Top 0.254: C6.- 49.62,19.8 49.62,17.27 C26.1 R6.2 49.94,15.3
  Top 0.406: X2.5 X2.3 51.31,5.87 51.31,13.93 49.94,15.3
RIGHT_N
  Top 0.203: FB7.2 27.31,8.22 C28.1 30.43,7.58 X5.2
RIGHT_P
  Top 0.203: X5.1 32.83,7.26 | 32.83,7.26 36.57,7.26 C29.1 | FB8.2 32.83,7.62 32.83,7.26
RINPUT1  (via drill 0.39)
  Top 0.203: IC3.5 30.99,17.4 31.36,17.77 31.36,19.6 33.08,21.32 v33.08,21.4 | v52.77,19.05 56.71,19.05 58.3,17.46 C24.2
  Bottom 0.203: v33.08,21.4 33.15,21.46 44.7,21.46 46.44,19.72 52.09,19.72 v52.77,19.05
RXD
  Bottom 0.406: RPI1.S10 | RPI1.S10 RPI1.10
SCL  (via drill 0.39)
  Top 0.203: CONN3.4 12.36,5.75 12.36,10.42 13.11,11.18 | IC3.17 29.01,11.18 13.11,11.18 | v13.61,18.18 13.55,18.12 13.55,11.62 13.11,11.18
  Bottom 0.203: RPI1.S5 13.58,24.21 13.58,18.18 v13.61,18.18
  Bottom 0.406: RPI1.S5 RPI1.5 | RPI1.5
SCLK
  Bottom 0.406: RPI1.S23 RPI1.23 | RPI1.23
SDA  (via drill 0.39)
  Top 0.203: IC3.18 29.99,11.2 29.52,10.73 13.59,10.73 12.83,9.97 12.83,4.64 12.13,3.94 10.92,3.94 10.66,4.2 CONN3.3 10.66,5.71 11.93,6.99 11.93,10.63 12.89,11.59 12.89,17.65 v12.51,18.03
  Bottom 0.203: RPI1.S3 10.91,23.63 12.57,21.96 12.57,18.09 v12.51,18.03
  Bottom 0.406: RPI1.S3 RPI1.3 | RPI1.3
TXD
  Bottom 0.406: RPI1.S8 | RPI1.S8 RPI1.8
VCC  (via drill 0.39)
  Top 0.305: v20.32,4.25 NEOPIX.2 20.32,9.46 21.13,10.27 24.96,10.27 25.71,9.52 C34.1
  Bottom 0.305: v20.32,4.25 SJ1.2
VMID
  Top 0.203: 39.57,13.36 35.51,13.36 35.46,13.41 IC3.27 | 39.57,13.36 40.01,13.36 C7.1 | C1.1 40.07,13.86 39.57,13.36

### Text on the board
tPlace: LED1 | LED2 | LED3 | Adafruit Voice / Bonnet | ON | Button | OFF | GPIO 12 | Lmic | Head / phone | Rmic | I2C | Right | 8Ω 1W | Left
bPlace: Voice Bonnet WM8960 / Stereo 8Ω 1W Speakers / Stereo Microphone / Stereo Headphone / I2S: #18,#19,#20,#21 | DotStars: #5,#6 / Button: #17 | JST Out / Voltage | 3V | 5V